# EasyEDA schematic BioSigGen_sch_v1.json
TITLE: Schematic, Biological Signal Generator; REV: A; Date: 7-Apr-2017; Sheet: 1/1; Drawn By: Brewing Java
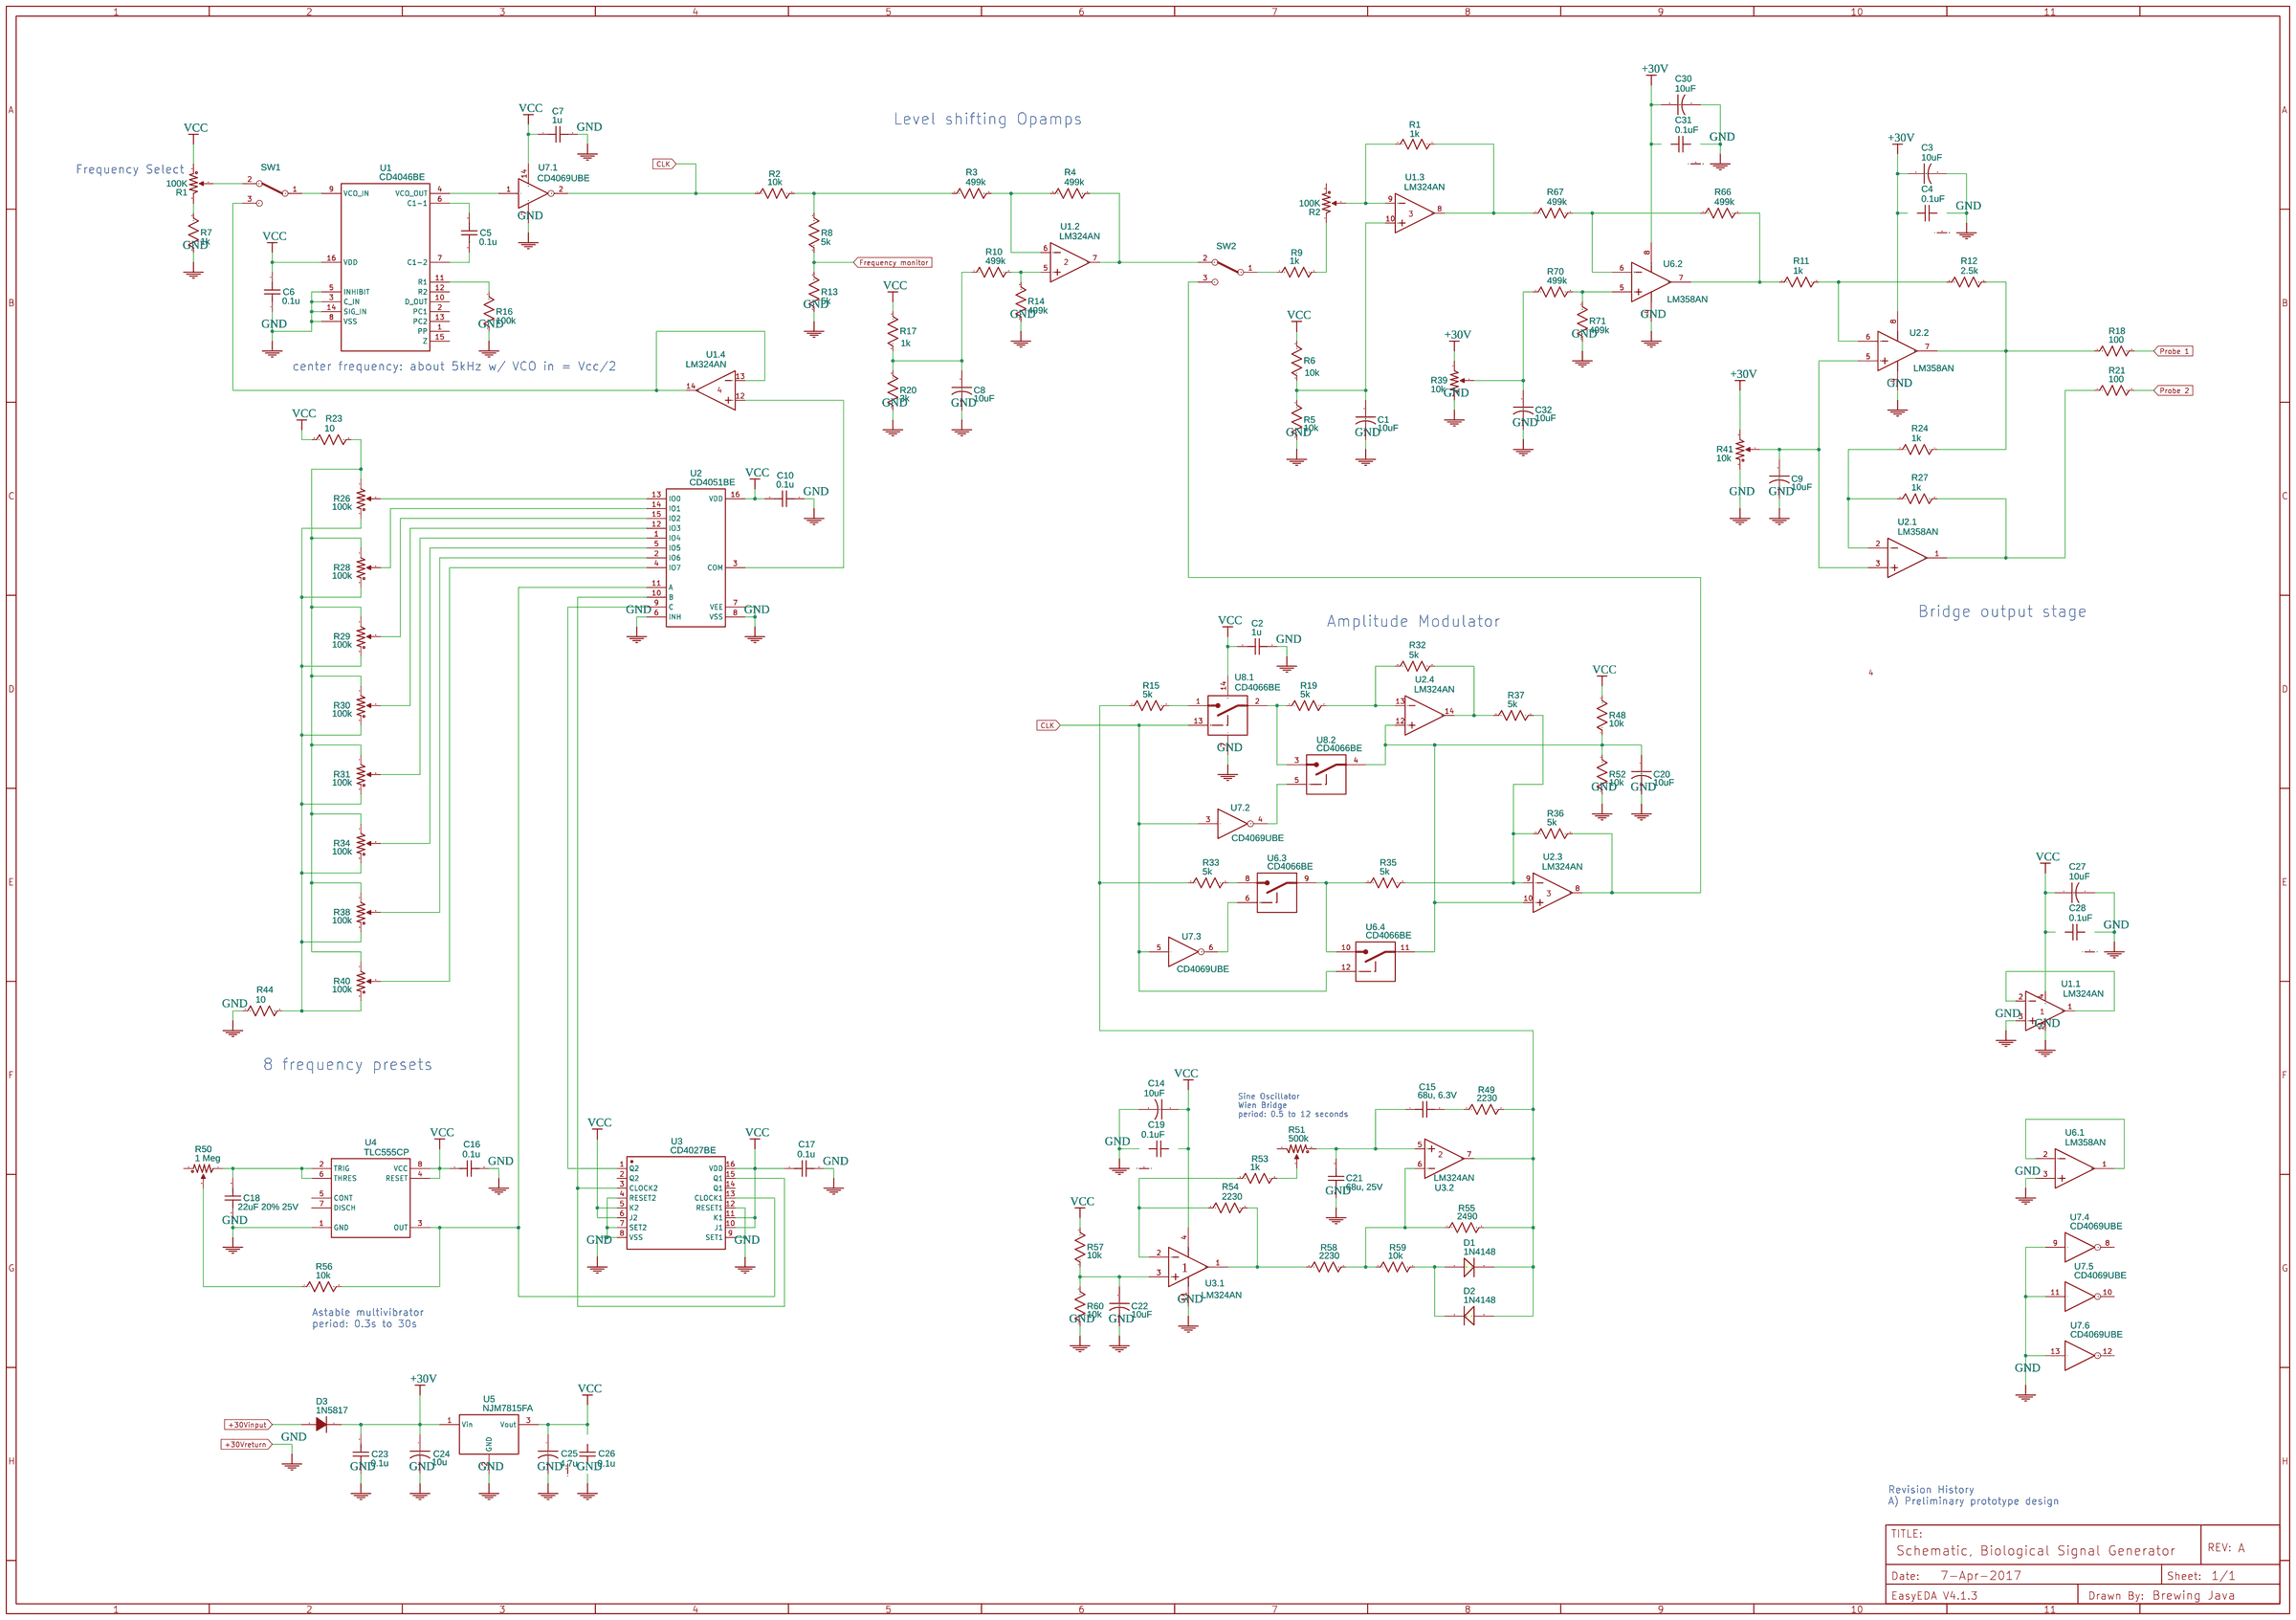
[diagram p0: schematic sheet]

## Parts
100K  R1  [RES-ADJ_3386P]
100K#2  R2  [RES-ADJ_3386P]
C1  10uF  [CP_8X13MM]
C2  1u  [RAD-0.1]
C3  10uF  [CP_8X13MM]
C4  0.1uF  [C1]
C5  0.1u  [RAD-0.1]
C6  0.1u  [RAD-0.1]
C7  1u  [RAD-0.1]
C8  10uF  [CP_8X13MM]
C9  10uF  [CP_8X13MM]
C10  0.1u  [RAD-0.1]
C14  10uF  [CP_8X13MM]
C15  68u, 6.3V  [RAD-0.1]
C16  0.1u  [RAD-0.1]
C17  0.1u  [RAD-0.1]
C18  22uF 20% 25V  [RAD-0.1]
C19  0.1uF  [C1]
C20  10uF  [CP_8X13MM]
C21  68u, 25V  [RAD-0.1]
C22  10uF  [CP_8X13MM]
C23  0.1u  [RAD-0.1]
C24  10u  [Pan_EF_I]
C25  4.7u  [Pan_EF_I]
C26  0.1u  [Vishay_K_15L2]
C27  10uF  [CP_8X13MM]
C28  0.1uF  [C1]
C30  10uF  [CP_8X13MM]
C31  0.1uF  [C1]
C32  10uF  [CP_8X13MM]
D1  1N4148  [DO-35]
D2  1N4148  [DO-35]
D3  1N5817  [DO-35]
NO  SW1
NO#2  SW2
R1  1k  [AXIAL-0.3]
R2  10k  [AXIAL-0.3]
R3  499k  [R3]
R4  499k  [R3]
R5  10k  [R3]
R6  10k  [R3]
R7  1k  [AXIAL-0.3]
R8  5k  [AXIAL-0.3]
R9  1k  [AXIAL-0.3]
R10  499k  [R3]
R11  1k  [R3]
R12  2.5k  [R3]
R13  5k  [AXIAL-0.3]
R14  499k  [R3]
R15  5k  [AXIAL-0.3]
R16  100k  [AXIAL-0.3]
R17  1k  [R3]
R18  100  [R3]
R19  5k  [AXIAL-0.3]
R20  3k  [R3]
R21  100  [R3]
R23  10  [AXIAL-0.3]
R24  1k  [R3]
R26  100k  [RES-ADJ_3386P]
R27  1k  [R3]
R28  100k  [RES-ADJ_3386P]
R29  100k  [RES-ADJ_3386P]
R30  100k  [RES-ADJ_3386P]
R31  100k  [RES-ADJ_3386P]
R32  5k  [R3]
R33  5k  [AXIAL-0.3]
R34  100k  [RES-ADJ_3386P]
R35  5k  [AXIAL-0.3]
R36  5k  [AXIAL-0.3]
R37  5k  [AXIAL-0.3]
R38  100k  [RES-ADJ_3386P]
R39  10k  [RES-ADJ_3386P]
R40  100k  [RES-ADJ_3386P]
R41  10k  [RES-ADJ_3386P]
R44  10  [AXIAL-0.3]
R48  10k  [R3]
R49  2230  [AXIAL-0.3]
R50  1 Meg  [RES-ADJ_3386P]
R51  500k  [RES-ADJ_3386P]
R52  10k  [R3]
R53  1k  [AXIAL-0.3]
R54  2230  [R3]
R55  2490  [AXIAL-0.3]
R56  10k  [AXIAL-0.3]
R57  10k  [R3]
R58  2230  [AXIAL-0.3]
R59  10k  [AXIAL-0.3]
R60  10k  [R3]
R66  499k  [R3]
R67  499k  [R3]
R70  499k  [R3]
R71  499k  [R3]
U1  CD4046BE
U1.1  LM324AN  [DIP14]
U1.2  LM324AN  [DIP14]
U1.3  LM324AN  [DIP14]
U1.4  LM324AN  [DIP14]
U2  CD4051BE
U2.1  LM358AN  [DIP8]
U2.2  LM358AN  [DIP8]
U2.3  LM324AN  [DIP14]
U2.4  LM324AN  [DIP14]
U3  CD4027BE  [DIP-16]
U3.1  LM324AN  [DIP14]
U3.2  LM324AN  [DIP14]
U4  TLC555CP
U5  NJM7815FA  [TO-220F3]
U6  LM358AN  [DIP8]  (sections 1,2,3,4)
U7  CD4069UBE  (sections 1,2,3,4,5,6)
U8  CD4066BE  (sections 1,2)

## Library data of the parts
100K 100K#2 R26 R28-R31 R34 R38-R41 R50 R51 = Potentiometer: K(%): 50; Manufacturer Part: ?
C1-C10 C14-C25 C27 C28 C30-C32 = Capacitor: Manufacturer Part: ?
C26 = Capacitor: Manufacturer Part: K104K15X7RF5TL2; Supplier: Digi-Key; Digi-Key: BC1084CT-ND
D1 D2 = -: EasyEDA: E14516; Supplier: EasyEDA; Manufacturer: ST
D3 = Diode: Manufacturer Part: 1N4148; Supplier: Digi-Key; Digi-Key: 1N4148FS-ND
NO NO#2 = -: Manufacturer Part: Switch SPDT; Contributor: Guest; Mounted: No
R1-R21 R23 R24 R27 R32 R33 R35-R37 R44 R48 R49 R52-R60 R66 R67 R70 R71 = Resistor: Manufacturer Part: ?
U1 = -: Supplier: Digi-Key; Digi-Key: 296-2052-5-ND; link: http://www.ti.com/lit/ds/symlink/cd4046b.pdf; Contributor: tcirineo
U1.1 = -: Quad Low-Power Operational Amplifier; catid: 20; sourceId: k31LJ5rb4; Manufacturer Part: ?
U1.2 U3.2 = -: Quad Low-Power Operational Amplifier; catid: 20; sourceId: R3lf9rI0i; Manufacturer Part: ?
U1.3 U2.3 = -: Quad Low-Power Operational Amplifier; catid: 20; sourceId: V71Uc6o4Y; Manufacturer Part: ?
U1.4 U2.4 = -: Quad Low-Power Operational Amplifier; catid: 20; sourceId: MYgasmEWe; Manufacturer Part: ?
U2 = -: Supplier: Digi-Key; Digi-Key: 296-2057-5-ND; link: http://www.ti.com/lit/ds/symlink/cd4051b.pdf; Contributor: tcirineo
U2.1 U6 = -: Low Power Dual Operational Amplifier, 8-pin MDIP; catid: 20; sourceId: 0qawqHZTb; Manufacturer Part: ?
U2.2 = -: Low Power Dual Operational Amplifier, 8-pin MDIP; catid: 20; sourceId: 53XfxPJCU; Manufacturer Part: ?
U3 = -: EasyEDA: E5239; Supplier: EasyEDA; Manufacturer: TI
U3.1 = -: Quad Low-Power Operational Amplifier; catid: 20; Manufacturer Part: ?
U4 = -: Supplier: Digi-Key; Digi-Key: 296-1857-5-ND; link: http://www.ti.com/lit/ds/symlink/tlc555.pdf; Contributor: tcirineo
U5 = -: Manufacturer Part: NJM7805FA; Supplier: Digi-Key; Digi-Key: NJM7805FA-ND; link: http://www.digikey.com/scripts/DkSearch/dksus.dll?Detail&itemSeq=214515814&uq=636177599579311896; Contributor: tcirineo
U7 = -: Supplier: Digi-Key; Digi-Key: 296-3518-5-ND; link: http://www.ti.com/lit/ds/symlink/cd4069ub.pdf; Contributor: tcirineo
U8 = -: Supplier: Digi-Key; Digi-Key: 296-2061-5-ND; link: http://www.ti.com/lit/ds/symlink/cd4066b.pdf; Contributor: tcirineo

## Nets
+30V: C3.1 C4.2 C23.2 C24.1 C30.1 C31.2 D3.K R39.1 R41.1 U2.2.8(V+) U5.1(Vin)
+30Vinput: D3.A
+30Vreturn: C1.2 C2.2 C3.2 C4.1 C6.1 C7.2 C8.2 C9.2 C10.1 C14.2 C16.2 C17.2 C18.1 C19.1 C20.2 C21.1 C22.2 C23.1 C24.2 C25.2 C26.1 C27.2 C28.1 C30.2 C31.1 C32.2 R5.1 R7.1 R13.1 R14.1 R16.1 R20.1 R39.3(2) R41.3(2) R44.1 R52.1 R60.1 R71.1 U1.3(C IN) U1.5(INHIBIT) U1.8(VSS) U1.14(SIG IN) U1.1.3(IN+) U1.1.11 U2.6(INH) U2.7(VEE) U2.8(VSS) U2.2.4(GND) U3.4(RESET2) U3.7(SET2) U3.8(VSS) U3.9(SET1) U3.12(RESET1) U3.1.11(V-) U4.1(GND) U5.2(GND) U6.3(INA+) U6.4(GND) U7.7(GND) U7.9(I) U7.11(I) U7.13(I) U8.7
VCC: 100K.3(2) C2.1 C6.2 C7.1 C10.2 C14.1 C16.1 C17.1 C19.2 C25.1 C26.2 C27.1 C28.2 R6.2 R17.2 R23.1 R48.2 R57.2 U1.16(VDD) U1.1.4(VCC) U2.16(VDD) U3.5(K2) U3.6(J2) U3.10(J1) U3.11(K1) U3.16(VDD) U3.1.4(V+) U4.4(RESET) U4.8(VCC) U5.3(Vout) U7.14(VDD) U8.14
CLK: R2.1 U6.12(13) U7.2(O) U7.3(I) U7.5(I) U8.13
Frequency monitor: R8.1 R13.2
Probe 1: R18.2
Probe 2: R21.2
Net-(100K#2-1): 100K#2.1 R9.2
Net-(100K#2-2): 100K#2.2(3) R1.1 U1.3.9(IN-)
Net-(100K-1): 100K.1 R7.2
Net-(100K-2): 100K.2(3) NO.2(NC)
Net-(C1-1): C1.1 R5.2 R6.1 U1.3.10(IN+)
Net-(C5-1): C5.1 U1.7(C1-2)
Net-(C5-2): C5.2 U1.6(C1-1)
Net-(C8-1): C8.1 R10.1 R17.1 R20.2
Net-(C9-1): C9.1 R41.2(3) U2.1.3(INA+) U2.2.5(INB+)
Net-(C15-1): C15.1 C21.2 R51.3(2) U3.2.5(IN+)
Net-(C15-2): C15.2 R49.1
Net-(C18-2): C18.2 R50.1 U4.2(TRIG) U4.6(THRES)
Net-(C20-1): C20.1 R48.1 R52.2 U2.3.10(IN+) U2.4.12(IN+) U6.11(2) U8.4(2)
Net-(C22-1): C22.1 R57.1 R60.2 U3.1.3(IN+)
Net-(C32-1): C32.1 R39.2(3) R70.1
Net-(D1-1): D1.1(A) D2.2(K) R59.2
Net-(D1-2): D1.2(K) D2.1(A) R15.1 R33.1 R49.2 R55.2 U3.2.7(OUT)
Net-(NO#2-1): NO#2.1(C) R9.1
Net-(NO#2-2): NO#2.2(NC) R4.2 U1.2.7(OUT)
Net-(NO#2-3): NO#2.3(NO) R36.2 U2.3.8(OUT)
Net-(NO-1): NO.1(C) U1.9(VCO IN)
Net-(NO-3): NO.3(NO) U1.4.13(IN-) U1.4.14(OUT)
Net-(R1-2): R1.2 R67.1 U1.3.8(OUT)
Net-(R2-2): R2.2 R3.1 R8.2
Net-(R3-2): R3.2 R4.1 U1.2.6(IN-)
Net-(R10-2): R10.2 R14.2 U1.2.5(IN+)
Net-(R11-1): R11.1 R66.2 U6.7(OUTB)
Net-(R11-2): R11.2 R12.1 U2.2.6(INB-)
Net-(R12-2): R12.2 R18.1 R24.1 U2.2.7(OUTB)
Net-(R15-2): R15.2 U8.1
Net-(R16-2): R16.2 U1.11(R1)
Net-(R19-1): R19.1 U8.2 U8.3(1)
Net-(R19-2): R19.2 R32.1 U2.4.13(IN-)
Net-(R21-1): R21.1 R27.2 U2.1.1(OUTA)
Net-(R23-2): R23.2 R26.1 R28.1 R29.1 R30.1 R31.1 R34.1 R38.1 R40.1
Net-(R24-2): R24.2 R27.1 U2.1.2(INA-)
Net-(R26-2): R26.2(3) U2.13(IO0)
Net-(R26-3): R26.3(2) R28.3(2) R29.3(2) R30.3(2) R31.3(2) R34.3(2) R38.3(2) R40.3(2) R44.2
Net-(R28-2): R28.2(3) U2.14(IO1)
Net-(R29-2): R29.2(3) U2.15(IO2)
Net-(R30-2): R30.2(3) U2.12(IO3)
Net-(R31-2): R31.2(3) U2.1(IO4)
Net-(R32-2): R32.2 R37.2 U2.4.14(OUT)
Net-(R33-2): R33.2 U6.8(1)
Net-(R34-2): R34.2(3) U2.5(IO5)
Net-(R35-1): R35.1 U6.9(2) U6.10(1)
Net-(R35-2): R35.2 R36.1 R37.1 U2.3.9(IN-)
Net-(R38-2): R38.2(3) U2.2(IO6)
Net-(R40-2): R40.2(3) U2.4(IO7)
Net-(R50-2): R50.2(3) R56.1
Net-(R51-2): R51.2(3) R53.2
Net-(R53-1): R53.1 R54.1 U3.1.2(IN-)
Net-(R54-2): R54.2 R58.1 U3.1.1(OUT)
Net-(R55-1): R55.1 R58.2 R59.1 U3.2.6(IN-)
Net-(R56-2): R56.2 U2.11(A) U3.13(CLOCK1) U4.3(OUT)
Net-(R66-1): R66.1 R67.2
Net-(R70-2): R70.2 R71.2 U6.5(INB+)
Net-(U1-4): U1.4(VCO OUT) U7.1(I)
Net-(U1.1-1): U1.1.1(OUT) U1.1.2(IN-)
Net-(U1.4-12): U1.4.12(IN+) U2.3(COM)
Net-(U2-9): U2.9(C) U3.1(Q2)
Net-(U2-10): U2.10(B) U3.3(CLOCK2) U3.15(Q1)
Net-(U6.1-1): U6.1(OUTA) U6.2(INA-)
Net-(U6.3-6): U6.6(13) U7.6(O)
Net-(U7.2-4): U7.4(O) U8.5(13)

Not connected (* = marked no-connect by the designer): 100K#2 3(2); R50 3(2); R51 1; U1 1(PP) 2(PC1) 10(D OUT) 12(R2) 13(PC2) 15(Z); U3 2(Q2) 14(Q1); U4 5(CONT) 7(DISCH); U7 8(O) 10(O) 12(O)

## Notes on the sheet
- Level shifting Opamps
- Frequency Select
- center frequency: about 5kHz w/ VCO in = Vcc/2
- Amplitude Modulator
- Bridge output stage
- 8 frequency presets
- Sine Oscillator
  Wien Bridge
  period: 0.5 to 12 seconds
- Astable multivibrator
  period: 0.3s to 30s
- Revision History
  A) Preliminary prototype design
